# Altium project b1.PrjPcb
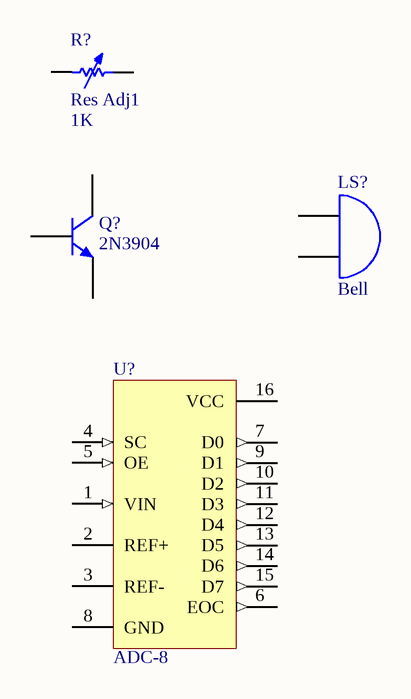
[diagram p0: PCI long card universal - 32 BIT.schdoc]
1 sheet, 4 parts. Net scope: global (net labels, ports and power ports of the same name join across sheets).
Board file: PCI long card universal - 32 BIT.PCBDOC

## Sheet PCI long card universal - 32 BIT.schdoc: PCI long card universal - 32 BIT
size A; Organization: Organization; Address1: Address1; Address2: Address2; Address3: Address3; Address4: Address4; DocumentNumber: 1; Revision: 0; SheetNumber: 2; SheetTotal: 2

### Parts
LS?  Bell  [PIN2]
Q?  2N3904  [TO-92A]
R?  Res Adj1  value 1K  [AXIAL-0.7]
U?  ADC-8  [SOT403-1_N]

### Nets

Not connected (* = marked no-connect by the designer): LS? 1(A) 2(B); Q? 1(E) 2(B) 3(C); R? 1 2; U? 1(VIN) 2(REF+) 3(REF-) 4(SC) 5(OE) 6(EOC) 7(D0) 8(GND) 9(D1) 10(D2) 11(D3) 12(D4) 13(D5) 14(D6) 15(D7) 16(VCC)

### Library data of the parts
LS? = Bell: Electrical Bell; Published: 24-Mar-1999; LatestRevisionDate: 17-Jul-2002; LatestRevisionNote: Re-released for DXP Platform.; PackageReference: PIN2; Publisher: Altium Limited
Q? = 2N3904: NPN General Purpose Amplifier; Published: 8-Jun-2000; LatestRevisionDate: 15-Jan-2003; LatestRevisionNote: PCB Footprint 'BCY-W3/D4.7' replaced; DatasheetVersion: 1997; PackageVersion: Sep-1998; PackageReference: TO-92A; Publisher: Altium Limited; PackageDescription: TO, Flat Index; 3 In-Line, Axial Leads; Body Dia. 4.5mm; Leads 0.51 x 0.48 mm (max); ComponentLink1Description: Manufacturer Link; ComponentLink1URL: http://www.fairchildsemi.com/; ComponentLink2Description: Datasheet; ComponentLink2URL: http://www.fairchildsemi.com/ds/2N%2F2N3904.pdf
R? = Res Adj1: Variable Resistor; Set Position: 0.5; Published: 8-Jun-2000; LatestRevisionDate: 17-Jul-2002; LatestRevisionNote: Re-released for DXP Platform.; PackageReference: AXIAL-0.7; Publisher: Altium Limited; PackageDescription: Axial Device, Thru-Hole; 2 Leads; 0.7 in Pin Spacing
U? = ADC-8: Generic 8-Bit A/D Converter; Published: 8-Jun-2000; LatestRevisionDate: 29-May-2009; LatestRevisionNote: IPC-7351 Footprint Added.; PackageVersion: Mar-2002; PackageReference: SOT403-1; Publisher: Altium Limited; PackageDescription: 16-Pin Thin Small Outline Package 0.65 mm Pitch; Code_JEDEC: MO-153